# Altium project InductiveCharging.PrjPcb
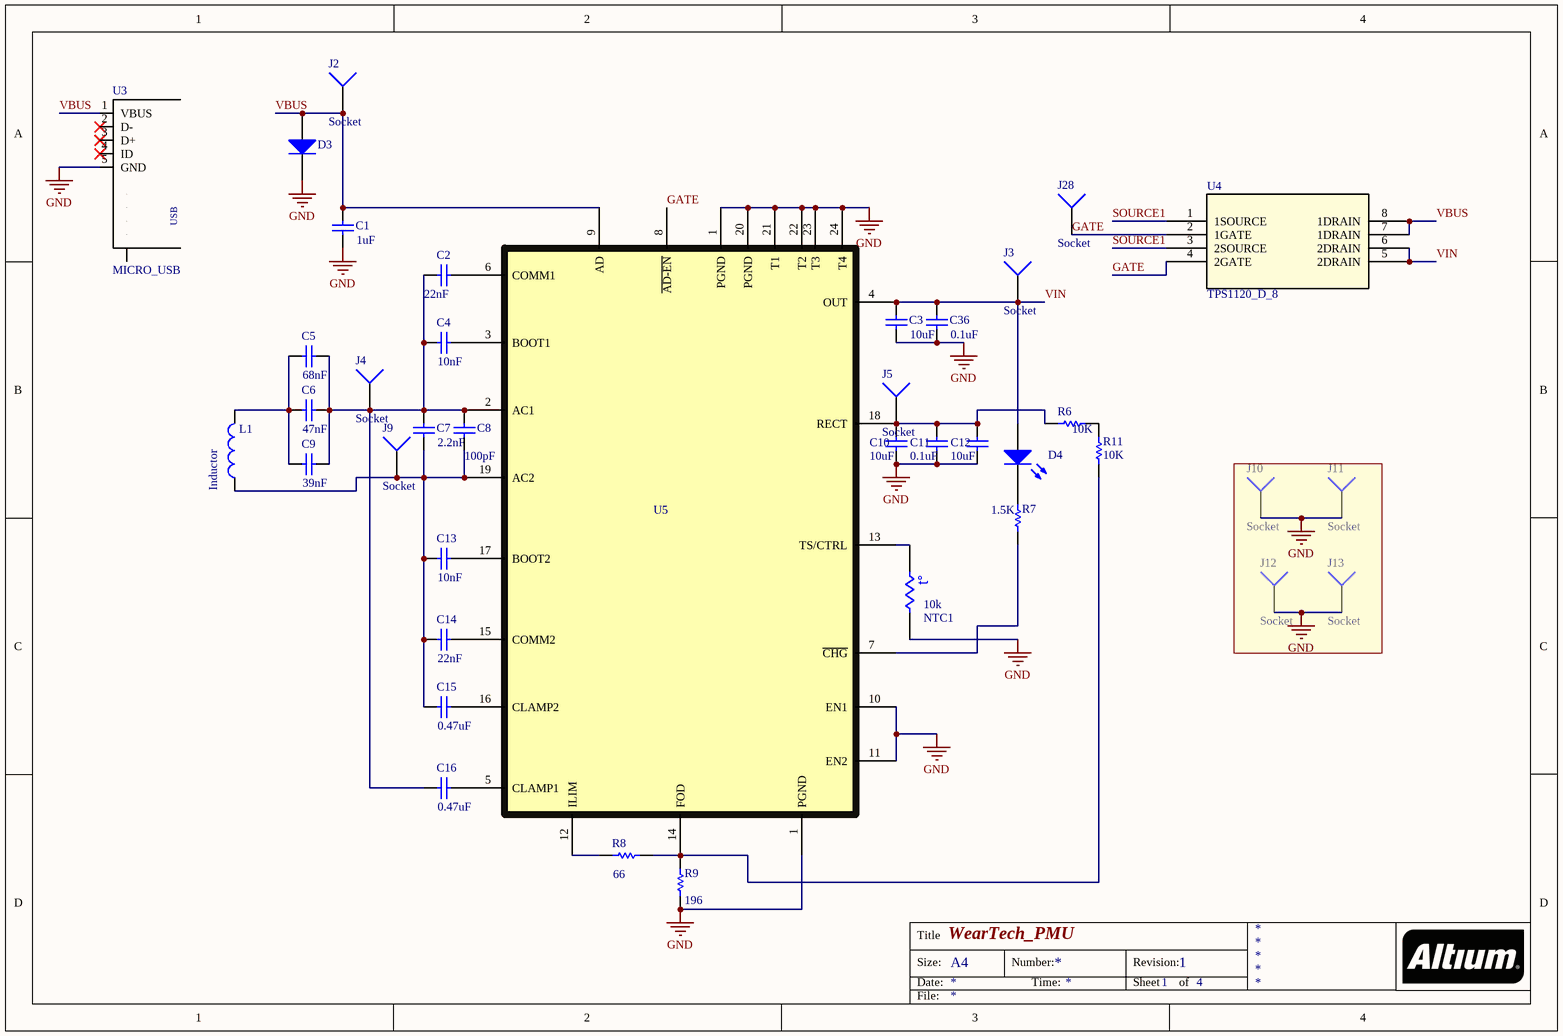
[diagram p0: Inductive.SchDoc]
4 sheets, 100 parts. Net scope: global (net labels, ports and power ports of the same name join across sheets).
Board file: WearTechPCB.PcbDoc
Sheets:
  Inductive.SchDoc
  BatteryCharger.SchDoc
  MCU.SchDoc
  MCU_PART2.SchDoc

## Sheet Inductive.SchDoc: WearTech_PMU
size A4; CompanyName: University Of Colorado Boulder; Revision: 1; SheetNumber: 1; SheetTotal: 4

### Parts
C1  value 1uF  [1608[0603]]  (hidden comment: Cap)
C2  value 22nF  [1608[0603]]  (hidden comment: Cap)
C3  value 10uF  [1608[0603]]  (hidden comment: Cap)
C4  value 10nF  [1608[0603]]  (hidden comment: Cap)
C5  value 68nF  [1608[0603]]  (hidden comment: Cap)
C6  value 47nF  [1608[0603]]  (hidden comment: Cap)
C7  value 2.2nF  [1608[0603]]  (hidden comment: Cap)
C8  value 100pF  [1608[0603]]  (hidden comment: Cap)
C9  value 39nF  [1608[0603]]  (hidden comment: Cap)
C10  value 10uF  [1608[0603]]  (hidden comment: Cap)
C11  value 0.1uF  [1608[0603]]  (hidden comment: Cap)
C12  value 10uF  [1608[0603]]  (hidden comment: Cap)
C13  value 10nF  [1608[0603]]  (hidden comment: Cap)
C14  value 22nF  [1608[0603]]  (hidden comment: Cap)
C15  value 0.47uF  [1608[0603]]  (hidden comment: Cap)
C16  value 0.47uF  [1608[0603]]  (hidden comment: Cap)
C36  value 0.1uF  [1608[0603]]  (hidden comment: Cap)
D3  Diode  [1608[0603]]  (value not drawn)
D4  LED0  [1608[0603]]  (value not drawn)
J2  Socket  [PIN1]
J3  Socket  [PIN1]
J4  Socket  [PIN1]
J5  Socket  [PIN1]
J9  Socket  [PIN1]
J10  Socket  [PIN1]
J11  Socket  [PIN1]
J12  Socket  [PIN1]
J13  Socket  [PIN1]
J28  Socket  [PIN1]
L1  Inductor  [1608[0603]]
NTC1  value 10k  [1608[0603]]  (hidden comment: Res Thermal)
R6  value 10K  [1608[0603]]  (hidden comment: Res1)
R7  value 1.5K  [1608[0603]]  (hidden comment: Res1)
R8  value 66  [1608[0603]]  (hidden comment: Res1)
R9  value 196  [1608[0603]]  (hidden comment: Res1)
R11  value 10K  [1608[0603]]  (hidden comment: Res1)
U3  MICRO_USB  [MICRO USB]
U4  TPS1120_D_8  [BlockSwitch]
U5  BQ51013B  [BQ51013B]  (value not drawn)

### Nets
GND: C1.1 C3.2 C10.2 C11.2 C12.2 C36.2 D3.2(K) J10.1 J11.1 J12.1 J13.1 NTC1.2 R9.2 U3.5(GND) U5.1(PGND) U5.10(EN1) U5.11(EN2) U5.20(PGND) U5.21(T1) U5.22(T2) U5.23(T3) U5.24(T4)
GATE: J28.1 U4.2(1GATE) U4.4(2GATE) U5.8(~{AD-EN})
SOURCE1: U4.1(1SOURCE) U4.3(2SOURCE)
VBUS: C1.2 D3.1(A) J2.1 U3.1(VBUS) U4.7(1DRAIN) U4.8(1DRAIN) U5.9(AD)
VIN: C3.1 C36.1 D4.1(A) J3.1 U4.5(2DRAIN) U4.6(2DRAIN) U5.4(OUT)
NetC2_1: C2.1 U5.6(COMM1)
NetC2_2: C2.2 C4.2 C5.1 C6.1 C7.1 C8.1 C9.1 C16.2 J4.1 U5.2(AC1)
NetC4_1: C4.1 U5.3(BOOT1)
NetC5_2: C5.2 C6.2 C9.2 L1.2
NetC7_2: C7.2 C8.2 C13.2 C14.2 C15.2 J9.1 L1.1 U5.19(AC2)
NetC10_1: C10.1 C11.1 C12.1 J5.1 R6.1 U5.18(RECT)
NetC13_1: C13.1 U5.17(BOOT2)
NetC14_1: C14.1 U5.15(COMM2)
NetC15_1: C15.1 U5.16(CLAMP2)
NetC16_1: C16.1 U5.5(CLAMP1)
NetD4_2: D4.2(K) R7.1
NetNTC1_1: NTC1.1 U5.13(TS/CTRL)
NetR6_2: R6.2 R11.2
NetR7_2: R7.2 U5.7(~{CHG})
NetR8_1: R8.1 U5.12(ILIM)
NetR8_2: R8.2 R9.1 R11.1 U5.14(FOD)

Not connected (* = marked no-connect by the designer): U3 2(D-)* 3(D+)* 4(ID)* M1(S) M2(S) S1(S) S2(S) S3(S) S4(S)

### Notes on the sheet
- Title
- Size:
- Date:
- A4
- Number:
- Time:
- Revision:
- Sheet
- of
- File:
- (in symbol MICRO_USB) USB
- (in symbol Res Thermal) t°

### Library data of the parts
C1 = Cap: Capacitor; Manufacture Part Number: C0603C105K9PACTU; Manufacturer: KEMET; Description: CAP CER 1UF 6.3V X5R 0603; Link: http://psearch.en.murata.com/browser/nosupport/?return=capacitor/product/GRM188R61E105KAAD%23.html; Link: Link; Digi-Key Part Number: 399-7848-1-ND; ComponentLink1URL: Component1URL; ComponentLink1Description: https://search.kemet.com/component-edge/download/datasheet/C0603C105K9PACTU.pdf
C2 C14 = Cap: Capacitor; Manufacture Part Number: CL10B223KA8NNWC; Manufacturer: Samsung Electro-Mechanics; Description: CAP CER 0.022UF 25V X7R 0603; Digi-Key Part Number: 1276-2000-1-ND; ComponentLink1URL: Component1URL; ComponentLink1Description: https://media.digikey.com/pdf/Data%20Sheets/Samsung%20PDFs/CL_Series_MLCC_ds.pdf
  C2: Link: http://psearch.en.murata.com/capacitor/product/GRM188B11E223MA01%23.html
  C14: Link: https://www.digikey.com/product-detail/en/samsung-electro-mechanics/CL10B223KA8NNWC/1276-2000-1-ND/3890086
C3 = Cap: Capacitor; Manufacture Part Number: GRM188R60J106ME47D; Manufacturer: Murata Electronics North America; Description: CAP CER 10UF 6.3V X5R 0603; Link: https://www.digikey.com/product-detail/en/murata-electronics-north-america/GRM188R60J106ME47D/490-3896-1-ND/965938; Digi-Key Part Number: 490-3896-1-ND; ComponentLink1URL: Component1URL; ComponentLink1Description: http://search.murata.co.jp/Ceramy/image/img/A01X/G101/ENG/GRM188R60J106ME47-01.pdf
C4 C13 = Cap: Capacitor; Manufacture Part Number: CL10B103KA8NNNC; Manufacturer: Samsung Electro-Mechanics; Description: CAP CER 10000PF 25V X7R 0603; Digi-Key Part Number: 1276-1132-1-ND; ComponentLink1URL: Component1URL; ComponentLink1Description: https://media.digikey.com/pdf/Data%20Sheets/Samsung%20PDFs/CL_Series_MLCC_ds.pdf
  C4: Link: http://psearch.en.murata.com/capacitor/product/GRM185R61E105MA12%23.html
  C13: Link: https://www.digikey.com/product-detail/en/samsung-electro-mechanics/CL10B103KA8NNNC/1276-1132-1-ND/3889218
C5 = Cap: Capacitor; Manufacture Part Number: CAP CER 0.068UF 25V X7R 0603; Manufacturer: Murata Electronics North America; Description: GRM188R71E683KA01D; Link: https://www.digikey.com/product-detail/en/murata-electronics-north-america/GRM188R71E683KA01D/490-1523-1-ND/587864; Digi-Key Part Number: 490-1523-1-ND; ComponentLink1URL: Component1URL; ComponentLink1Description: http://search.murata.co.jp/Ceramy/image/img/A01X/G101/ENG/GRM188R71E683KA01-01.pdf
C6 = Cap: Capacitor; Manufacture Part Number: CL10B473KA8NFNC; Manufacturer: Samsung; Description: CAP CER 0.047UF 25V X7R 0603; Link: https://www.digikey.com/product-detail/en/samsung-electro-mechanics/CL10B473KA8NFNC/1276-2072-1-ND/3890158; Digi-Key Part Number: 1276-2072-1-ND; ComponentLink1URL: Component1URL; ComponentLink1Description: https://media.digikey.com/pdf/Data%20Sheets/Samsung%20PDFs/CL_Series_MLCC_ds.pdf
C7 = Cap: Capacitor; Manufacture Part Number: C0603C222K3RACTU; Manufacturer: KEMET; Description: CAP CER 2200PF 25V X7R 0603; Link: https://www.digikey.com/product-detail/en/kemet/C0603C222K3RACTU/399-9040-1-ND/3522557; Digi-Key Part Number: 399-9040-1-ND; ComponentLink1URL: Component1URL; ComponentLink1Description: https://search.kemet.com/component-edge/download/datasheet/C0603C222K3RACTU.pdf
C8 = Cap: Capacitor; Manufacture Part Number: C0603C104K3RACTU; Manufacturer: KEMET; Description: CAP CER 0.1UF 25V X7R 0603; Link: https://www.digikey.com/product-detail/en/kemet/C0603C104K3RACTU/399-1281-1-ND/416057; Digi-Key Part Number: 399-1281-1-ND; ComponentLink1URL: Component1URL; ComponentLink1Description: https://search.kemet.com/component-edge/download/datasheet/C0603C104K3RACTU.pdf
C9 = Cap: Capacitor; Manufacture Part Number: C0603C393K3RACTU; Manufacturer: KEMET; Description: CAP CER 0.039UF 25V X7R 0603; Link: https://www.digikey.com/product-detail/en/kemet/C0603C393K3RACTU/399-7914-1-ND/3471637; Digi-Key Part Number: 399-7914-1-ND; ComponentLink1URL: Component1URL; ComponentLink1Description: https://search.kemet.com/component-edge/download/datasheet/C0603C393K3RACTU.pdf
C10 = Cap: Capacitor; Manufacture Part Number: GRM188R61C106KAALD; Manufacturer: Murata Electronics North AmericaMurata Electronics North America; Description: CAP CER 10UF 16V X5R 0603; Link: https://www.digikey.com/product-detail/en/murata-electronics-north-america/GRM188R61C106KAALD/490-10728-1-ND/5251372; Digi-Key Part Number: 490-10728-1-ND; ComponentLink1URL: Component1URL; ComponentLink1Description: http://search.murata.co.jp/Ceramy/image/img/A01X/G101/ENG/GRM188R61C106KAAL-01.pdf
C11 = Cap: Capacitor; Manufacture Part Number: CAP CER 0.1UF 16V X7R 0603; Description: 0603YC104JAT2A; Link: https://www.digikey.com/product-detail/en/avx-corporation/0603YC104JAT2A/478-3726-1-ND/1116424; Digi-Key Part Number: Digi-Key Part Number; ComponentLink1URL: Component1URL; ComponentLink1Description: cOM; Manufacturer: Manufacturer
C12 = Cap: Capacitor; Manufacture Part Number: GRM188R61C106KAALD; Manufacturer: Murata Electronics North America; Description: CAP CER 10UF 16V X5R 0603; Link: https://www.digikey.com/product-detail/en/murata-electronics-north-america/GRM188R61C106KAALD/490-10728-1-ND/5251372; Digi-Key Part Number: 490-10728-1-ND; ComponentLink1URL: Component1URL; ComponentLink1Description: http://search.murata.co.jp/Ceramy/image/img/A01X/G101/ENG/GRM188R61C106KAAL-01.pdf
C15 = Cap: Capacitor; Manufacture Part Number: CAP CER 0.47UF 25V X7R 0603; Manufacturer: Murata Electronics North America; Description: GRM188R71E474KA12D; Link: https://www.digikey.com/product-detail/en/murata-electronics-north-america/GRM188R71E474KA12D/490-3291-1-ND/702832; Digi-Key Part Number: 490-3291-1-ND; ComponentLink1URL: Component1URL; ComponentLink1Description: http://search.murata.co.jp/Ceramy/image/img/A01X/G101/ENG/GRM188R71E474KA12-01.pdf
C16 = Cap: Capacitor; Manufacture Part Number: GRM188R71E474KA12D; Manufacturer: Murata Electronics North America; Description: CAP CER 0.47UF 25V X7R 0603; Link: https://www.digikey.com/product-detail/en/murata-electronics-north-america/GRM188R71E474KA12D/490-3291-1-ND/702832; Digi-Key Part Number: 490-3291-1-ND; ComponentLink1URL: Component1URL; ComponentLink1Description: http://search.murata.co.jp/Ceramy/image/img/A01X/G101/ENG/GRM188R71E474KA12-01.pdf
C36 = Cap: Capacitor; Manufacture Part Number: GRM188R70J104KA01D; Manufacturer: Murata Electronics North America; Description: CAP CER 0.1UF 6.3V X7R 0603; Link: https://www.digikey.com/product-detail/en/murata-electronics-north-america/GRM188R70J104KA01D/490-9730-1-ND/4934899; Digi-Key Part Number: 490-9730-1-ND; ComponentLink1URL: Component1URL; ComponentLink1Description: http://search.murata.co.jp/Ceramy/image/img/A01X/G101/ENG/GRM188R70J104KA01-01.pdf
D3 = Diode: Default Diode; Manufacture Part Number: SMF05CT1G; Manufacturer: ON Semiconductor; Description: TVS DIODE 5VWM 12.5VC SC88; Link: https://www.digikey.com/product-detail/en/SMF05CT1G/SMF05CT1GOSCT-ND/1967287; Digi-Key Part Number: SMF05CT1GOSCT-ND; ComponentLink1URL: Component1URL; ComponentLink1Description: http://www.onsemi.com/pub/Collateral/SMF05C-D.PDF
D4 = LED0: Typical INFRARED GaAs LED; Manufacture Part Number: LO L29K-H2K1-24-Z; Manufacturer: OSRAM Opto Semiconductors Inc.; Description: LED ORANGE DIFFUSED 0603 SMD; Link: https://www.digikey.com/product-detail/en/yageo/RC0603JR-0710KL/311-10KGRCT-ND/729647; Digi-Key Part Number: 475-2740-1-ND; ComponentLink1URL: Component1URL; ComponentLink1Description: http://www.osram-os.com/Graphics/XPic0/00077105_0.pdf
J2-J5 J9-J13 J28 = Socket: Manufacture Part Number: 68000-200HLF; Manufacturer: Amphenol FCI; Description: Description; Link: https://www.digikey.com/product-detail/en/amphenol-fci/68000-200HLF/609-5099-1-ND/5968545; Digi-Key Part Number: 609-5099-1-ND; ComponentLink1URL: Component1URL; ComponentLink1Description: http://cdn.amphenol-icc.com/media/wysiwyg/files/drawing/68000.pdf
L1 = Inductor: RX 1 COIL 1 LAYER 10.7UH; Manufacturer: Vishay Dale; Value: 10mH; Manufacture Part Number: Manufacture Part Number; Link: https://www.digikey.com/product-detail/en/vishay-dale/IWAS3827ECEB100J50/541-1695-ND/3641244; Digi-Key Part Number: 541-1695-ND; ComponentLink1URL: Component1URL; ComponentLink1Description: http://www.vishay.com/docs/34338/iwas3827.pdf
NTC1 = Res Thermal: Thermistor; Manufacturer: Yageo; Description: RC0603JR-0710KL; Manufacture Part Number: RC0603JR-0710KL; Link: https://www.digikey.com/product-detail/en/yageo/RC0603JR-0710KL/311-10KGRCT-ND/729647; Digi-Key Part Number: 311-10KGRCT-ND; ComponentLink1URL: Component1URL; ComponentLink1Description: http://www.yageo.com.tw/exep/pages/download/literatures/PYu-R_INT-thick_7.pdf
R6 R11 = Res1: Resistor; Manufacture Part Number: RC0603JR-0710KL; Manufacturer: Yageo; Description: RES SMD 10K OHM 5% 1/10W 0603; Link: https://www.digikey.com/product-detail/en/yageo/RC0603JR-0710KL/311-10KGRCT-ND/729647; Digi-Key Part Number: 311-10KGRCT-ND; ComponentLink1URL: Component1URL; ComponentLink1Description: http://www.yageo.com.tw/exep/pages/download/literatures/PYu-R_INT-thick_7.pdf
R7 = Res1: Resistor; Manufacture Part Number: RC0603JR-071K5L; Manufacturer: Yageo; Description: RES SMD 1.5K OHM 5% 1/10W 0603; Link: https://www.digikey.com/product-detail/en/yageo/RC0603JR-071K5L/311-1.5KGRCT-ND/729636; Digi-Key Part Number: 311-1.5KGRCT-ND; ComponentLink1URL: Component1URL; ComponentLink1Description: http://www.yageo.com.tw/exep/pages/download/literatures/PYu-R_INT-thick_7.pdf
R8 = Res1: Resistor; Manufacture Part Number: RC0603FR-0766R5L; Manufacturer: Yageo; Description: RES SMD 66.5 OHM 1% 1/10W 0603; Link: https://www.digikey.com/product-detail/en/yageo/RC0603FR-0766R5L/311-66.5HRCT-ND/730294; Digi-Key Part Number: 311-66.5HRCT-ND; ComponentLink1URL: Component1URL; ComponentLink1Description: http://www.yageo.com/documents/recent/PYu-RC_Group_51_RoHS_L_8.pdf
R9 = Res1: Resistor; Manufacture Part Number: RC0603FR-07196RL; Manufacturer: Yageo; Description: RES SMD 196 OHM 1% 1/10W 0603; Link: https://www.digikey.com/product-detail/en/yageo/RC0603FR-07196RL/311-196HRCT-ND/729953; Digi-Key Part Number: 311-196HRCT-ND; ComponentLink1URL: Component1URL; ComponentLink1Description: http://www.yageo.com/documents/recent/PYu-RC_Group_51_RoHS_L_8.pdf
U3 = MICRO_USB: CONN USB MICRO B RECPT SMT R/A; Manufacture Part Number: 10118192-0001LF; Manufacturer: Amphenol FCI; Link: https://www.digikey.com/product-detail/en/amphenol-fci/10118192-0001LF/609-4613-1-ND/2785378; Digi-Key Part Number: 609-4613-1-ND; ComponentLink1URL: Component1URL; ComponentLink1Description: http://cdn.amphenol-icc.com/media/wysiwyg/files/drawing/10118192.pdf
U4 = TPS1120_D_8: Manufacturer: Texas Instruments; Description: Description; Manufacture Part Number: Manufacture Part Number; Link: https://www.digikey.com/products/en/discrete-semiconductor-products/transistors-fets-mosfets-arrays/289?k=tps1120&k=&pkeyword=tps1120&pv7=2&FV=ffe00121&mnonly=0&ColumnSort=0&page=1&stock=1&quantity=0&ptm=0&fid=0&pageSize=25; Digi-Key Part Number: 296-1352-1-ND; ComponentLink1URL: Component1URL; ComponentLink1Description: http://www.ti.com/lit/gpn/TPS1120
U5 = BQ51013B: Manufacture Part Number: BQ51013BRHLR; Manufacturer: Texas Instruments; Description: IC WIRELESS PWR RCVR 20QFN; Link: https://www.digikey.com/product-detail/en/texas-instruments/BQ51013BRHLR/296-38885-1-ND/5142996; Digi-Key Part Number: 296-38885-1-ND; ComponentLink1URL: Component1URL; ComponentLink1Description: http://www.ti.com/lit/ds/symlink/bq51013b.pdf

## Sheet BatteryCharger.SchDoc: WearTech_PMU_Part2
size A4; DrawnBy: WearTech; Revision: 1; SheetNumber: 2; SheetTotal: 4
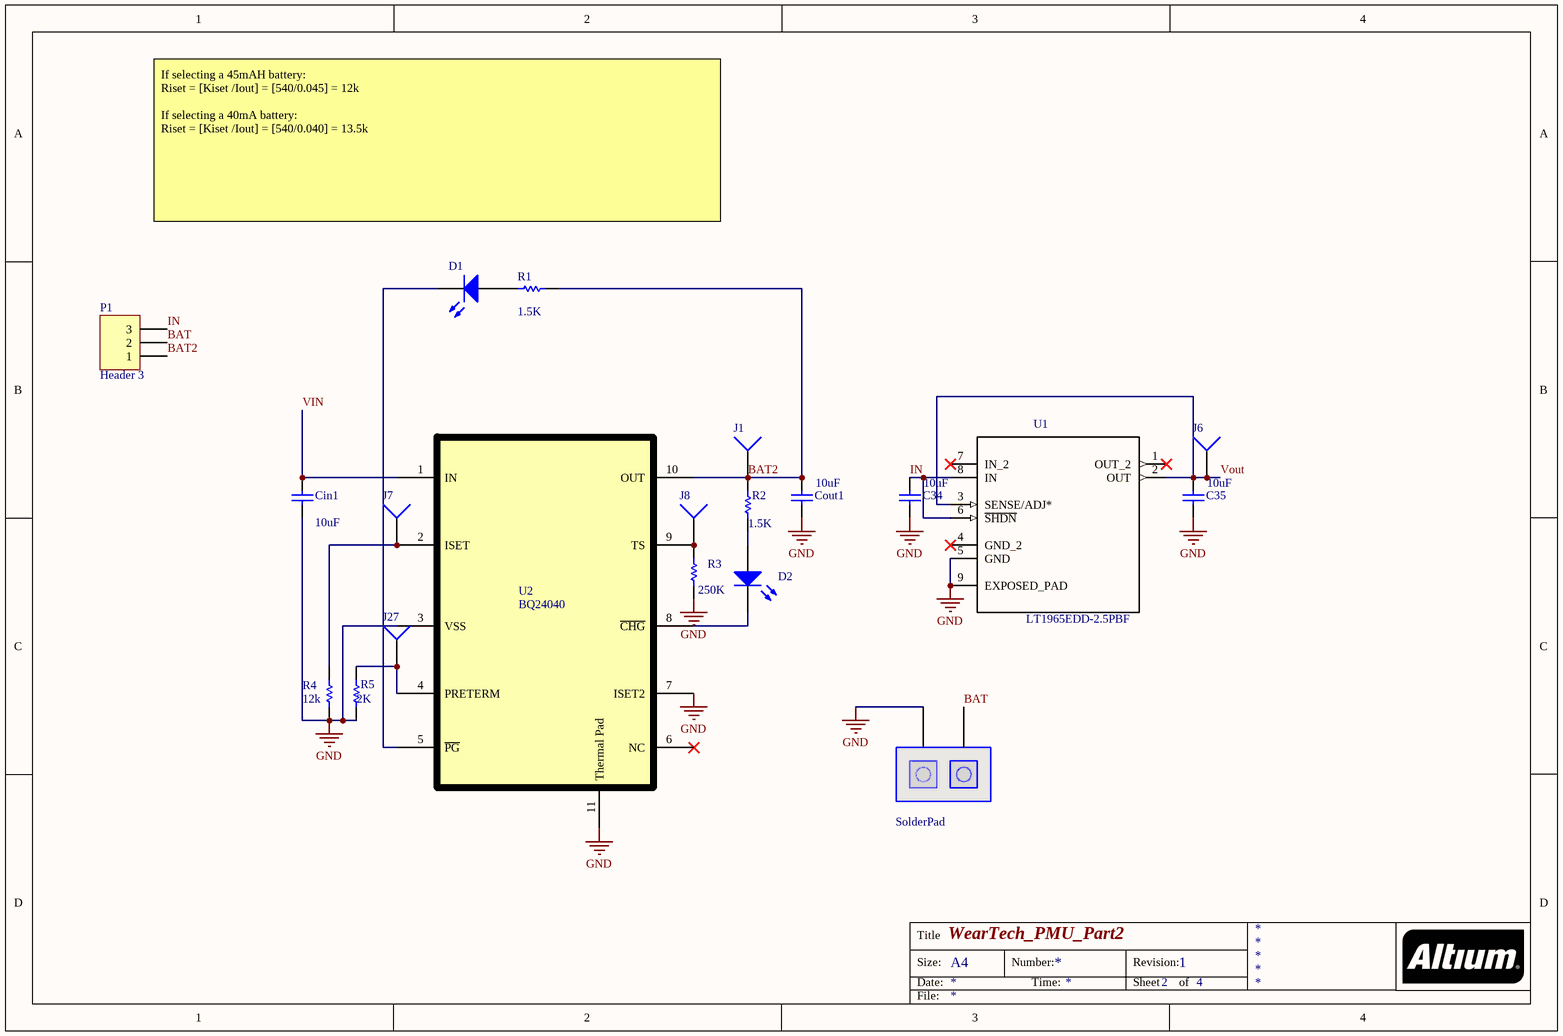
[diagram p1: BatteryCharger.SchDoc]

### Parts
1  SolderPad  [bATTERY_CONNECTION]
C34  value 10uF  [1608[0603]]  (hidden comment: Cap)
C35  value 10uF  [1608[0603]]  (hidden comment: Cap)
Cin1  value 10uF  [1608[0603]]  (hidden comment: Cap)
Cout1  value 10uF  [1608[0603]]  (hidden comment: Cap)
D1  LED0  [1608[0603]]  (value not drawn)
D2  LED0  [1608[0603]]  (value not drawn)
J1  Socket  [PIN1]  (value not drawn)
J6  Socket  [PIN1]  (value not drawn)
J7  Socket  [PIN1]  (value not drawn)
J8  Socket  [PIN1]  (value not drawn)
J27  Socket  [PIN1]  (value not drawn)
P1  Header 3  [HDR1X3]
R1  value 1.5K  [1608[0603]]  (hidden comment: Res1)
R2  value 1.5K  [1608[0603]]  (hidden comment: Res1)
R3  value 250K  [1608[0603]]  (hidden comment: Res1)
R4  value 12k  [1608[0603]]  (hidden comment: Res1)
R5  value 2K  [1608[0603]]  (hidden comment: Res1)
U1  LT1965EDD-2.5PBF  [LT1965]
U2  BQ24040  [BQ24040]

### Nets
GND: 1.2(GND) C34.2 C35.2 Cin1.2 Cout1.2 R3.1 R4.2 R5.2 U1.5(GND) U1.9(EXPOSED_PAD) U2.3(VSS) U2.7(ISET2) U2.11(Thermal_Pad)
BAT: 1.1(BAT) P1.2
BAT2: Cout1.1 J1.1 P1.1 R1.2 R2.1 U2.10(OUT)
IN: C34.1 P1.3 U1.6(~{SHDN}) U1.8(IN)
VIN: Cin1.1 U2.1(IN)
Vout: C35.1 J6.1 U1.2(OUT) U1.3(SENSE/ADJ*)
NetD1_1: D1.1(A) R1.1
NetD1_2: D1.2(K) U2.5(~{PG})
NetD2_1: D2.1(A) R2.2
NetD2_2: D2.2(K) U2.8(~{CHG})
NetJ7_1: J7.1 R4.1 U2.2(ISET)
NetJ8_1: J8.1 R3.2 U2.9(TS)
NetJ27_1: J27.1 R5.1 U2.4(PRETERM)

Not connected (* = marked no-connect by the designer): U1 1(OUT_2)* 4(GND_2)* 7(IN_2)*; U2 6(NC)*

### Notes on the sheet
- If selecting a 45mAH battery:
  Riset = [Kiset /Iout] = [540/0.045] = 12k
  If selecting a 40mA battery:
  Riset = [Kiset /Iout] = [540/0.040] = 13.5k
- Title
- Size:
- Date:
- A4
- Number:
- Time:
- Revision:
- Sheet
- of
- File:

### Library data of the parts
1 = SolderPad: Manufacturer: b; Link: Link; Description: Description; Manufacture Part Num: Manufacture Part Num; DigiKey Part Number: D; ComponentLink1URL: Datasheet; ComponentLink1Description: c
C34 Cout1 = Cap: Capacitor; Manufacture Part Num: 06034D106MAT2A; Manufacturer: AVX Corporation; Description: CAP CER 10UF 4V X5R 0603; Link: https://www.digikey.com/product-detail/en/avx-corporation/06034D106MAT2A/478-5718-1-ND/2136326; DigiKey Part Number: 478-5718-1-ND; ComponentLink1URL: Datasheet; ComponentLink1Description: http://datasheets.avx.com/cx5r.pdf
C35 = Cap: Capacitor; Manufacture Part Num: 06034D106MAT2A; Manufacturer: Murata Electronics North America; Description: CAP CER 10UF 4V X5R 0603; Link: https://www.digikey.com/product-detail/en/avx-corporation/06034D106MAT2A/478-5718-1-ND/2136326; DigiKey Part Number: 490-8278-1-ND; ComponentLink1URL: Datasheet; ComponentLink1Description: http://search.murata.co.jp/Ceramy/image/img/A01X/partnumbering_e_01.pdf
Cin1 = Cap: Capacitor; Manufacture Part Num: GRM188R60J106ME47D; Manufacturer: Murata Electronics North America; Description: CAP CER 10UF 6.3V X5R 0603; Link: https://www.digikey.com/product-detail/en/murata-electronics-north-america/GRM188R60J106ME47D/490-3896-1-ND/965938; DigiKey Part Number: 490-3896-1-ND; ComponentLink1URL: Datasheet; ComponentLink1Description: http://search.murata.co.jp/Ceramy/image/img/A01X/G101/ENG/GRM188R60J106ME47-01.pdf
D1 D2 = LED0: Typical INFRARED GaAs LED; Manufacture Part Num: LO L29K-H2K1-24-Z; Manufacturer: OSRAM Opto Semiconductors Inc.; Description: LED ORANGE DIFFUSED 0603 SMD; Link: https://www.digikey.com/product-detail/en/osram-opto-semiconductors-inc/LO-L29K-H2K1-24-Z/475-2740-1-ND/1938907; ComponentLink1URL: Datasheet; ComponentLink1Description: http://www.osram-os.com/Graphics/XPic0/00077105_0.pdf
  D1: DigiKey Part Number: 475-2740-1-ND
  D2: DigiKey Part Number: 475475-2740-1-ND
J1 J6-J8 J27 = Socket: Manufacture Part Num: 68000-200HLF; Manufacturer: Amphenol FCI; Link: https://www.digikey.com/product-detail/en/amphenol-fci/68000-200HLF/609-5099-1-ND/5968545; Description: Description; DigiKey Part Number: 609-5099-1-ND; ComponentLink1URL: Datasheet; ComponentLink1Description: http://cdn.amphenol-icc.com/media/wysiwyg/files/drawing/68000.pdf
P1 = Header 3: Header, 3-Pin; Manufacturer: Wurth Electronics Inc.; Description: CONN HEADER 3 POS 2.54; Link: https://www.digikey.com/product-detail/en/wurth-electronics-inc/61300311121/732-5316-ND/4846825; Manufacture Part Num: Manufacture Part Num; DigiKey Part Number: 732-5316-ND; ComponentLink1URL: Datasheet; ComponentLink1Description: http://katalog.we-online.de/em/datasheet/6130xx11121.pdf
R1 R2 = Res1: Resistor; Manufacture Part Num: RC0603JR-071K5L; Manufacturer: Yageo; Description: RES SMD 1.5K OHM 5% 1/10W 0603; Link: https://www.digikey.com/product-detail/en/yageo/RC0603JR-071K5L/311-1.5KGRCT-ND/729636; DigiKey Part Number: 311-1.5KGRCT-ND; ComponentLink1URL: Datasheet; ComponentLink1Description: http://www.yageo.com.tw/exep/pages/download/literatures/PYu-R_INT-thick_7.pdf
R3 = Res1: Resistor; Manufacture Part Num: RC0402JR-0710KL; Manufacturer: Yageo; Description: RES SMD 10K OHM 5% 1/16W 0402; Link: https://www.digikey.com/product-detail/en/yageo/RC0402JR-0710KL/311-10KJRTR-ND/726418; DigiKey Part Number: 311-12KGRCT-ND; ComponentLink1URL: Datasheet; ComponentLink1Description: http://www.yageo.com/documents/recent/PYu-RC_Group_51_RoHS_L_8.pdf
R4 = Res1: Resistor; Manufacture Part Num: RC0603JR-0712KL; Manufacturer: Yageo; Description: RES SMD 12K OHM 5% 1/10W 0603; Link: https://www.digikey.com/product-detail/en/yageo/RC0603JR-0712KL/311-12KGRCT-ND/729656; DigiKey Part Number: 311-12KGRCT-ND; ComponentLink1URL: Datasheet; ComponentLink1Description: http://www.yageo.com/documents/recent/PYu-RC_Group_51_RoHS_L_8.pdf
R5 = Res1: Resistor; Manufacture Part Num: ERJ-3EKF2001V; Manufacturer: Panasonic Electronic Components; Description: RES SMD 2K OHM 1% 1/10W 0603; Link: https://www.digikey.com/product-detail/en/panasonic-electronic-components/ERJ-3EKF2001V/P2.00KHCT-ND/198219; DigiKey Part Number: P2.00KHCT-ND; ComponentLink1URL: Datasheet; ComponentLink1Description: https://industrial.panasonic.com/cdbs/www-data/pdf/RDA0000/AOA0000C304.pdf
U1 = LT1965EDD-2.5PBF: PMIC - LDO voltage regulator Linear Technology LT1965EDD-2.5#PBF Positive, fixed DFN 8 (3x3); Manufacture Part Num: LT1965IDD-2.5#PBF; Description: IC REG LINEAR 2.5V 1.1A 8DFN; Value: *; Link: https://www.digikey.com/product-detail/en/linear-technology/LT1965IDD-2.5-PBF/LT1965IDD-2.5-PBF-ND/2107616; DigiKey Part Number: LT1965IDD-2.5#PBF-ND; ComponentLink1URL: Datasheet; ComponentLink1Description: http://www.linear.com/docs/25320; Manufacturer: Linear Technology
U2 = BQ24040: Manufacture Part Num: BQ24040DSQT; Manufacturer: Texas Instruments; Description: IC BATT CHG LI-ION 1 CELL 10SON; Link: https://www.digikey.com/products/en/integrated-circuits-ics/pmic-battery-chargers/781?k=BQ24040DSQT&k=&pkeyword=BQ24040DSQT&pv7=2&mnonly=0&ColumnSort=0&page=1&stock=1&quantity=0&ptm=0&fid=0&pageSize=25; DigiKey Part Number: 296-25136-1-ND; ComponentLink1URL: Datasheet; ComponentLink1Description: http://www.ti.com/lit/ds/symlink/bq24040.pdf

## Sheet MCU.SchDoc: WearTech-MCU_P1
size A4; Revision: 1; SheetNumber: 2; SheetTotal: 3; ProjectName: WearTech
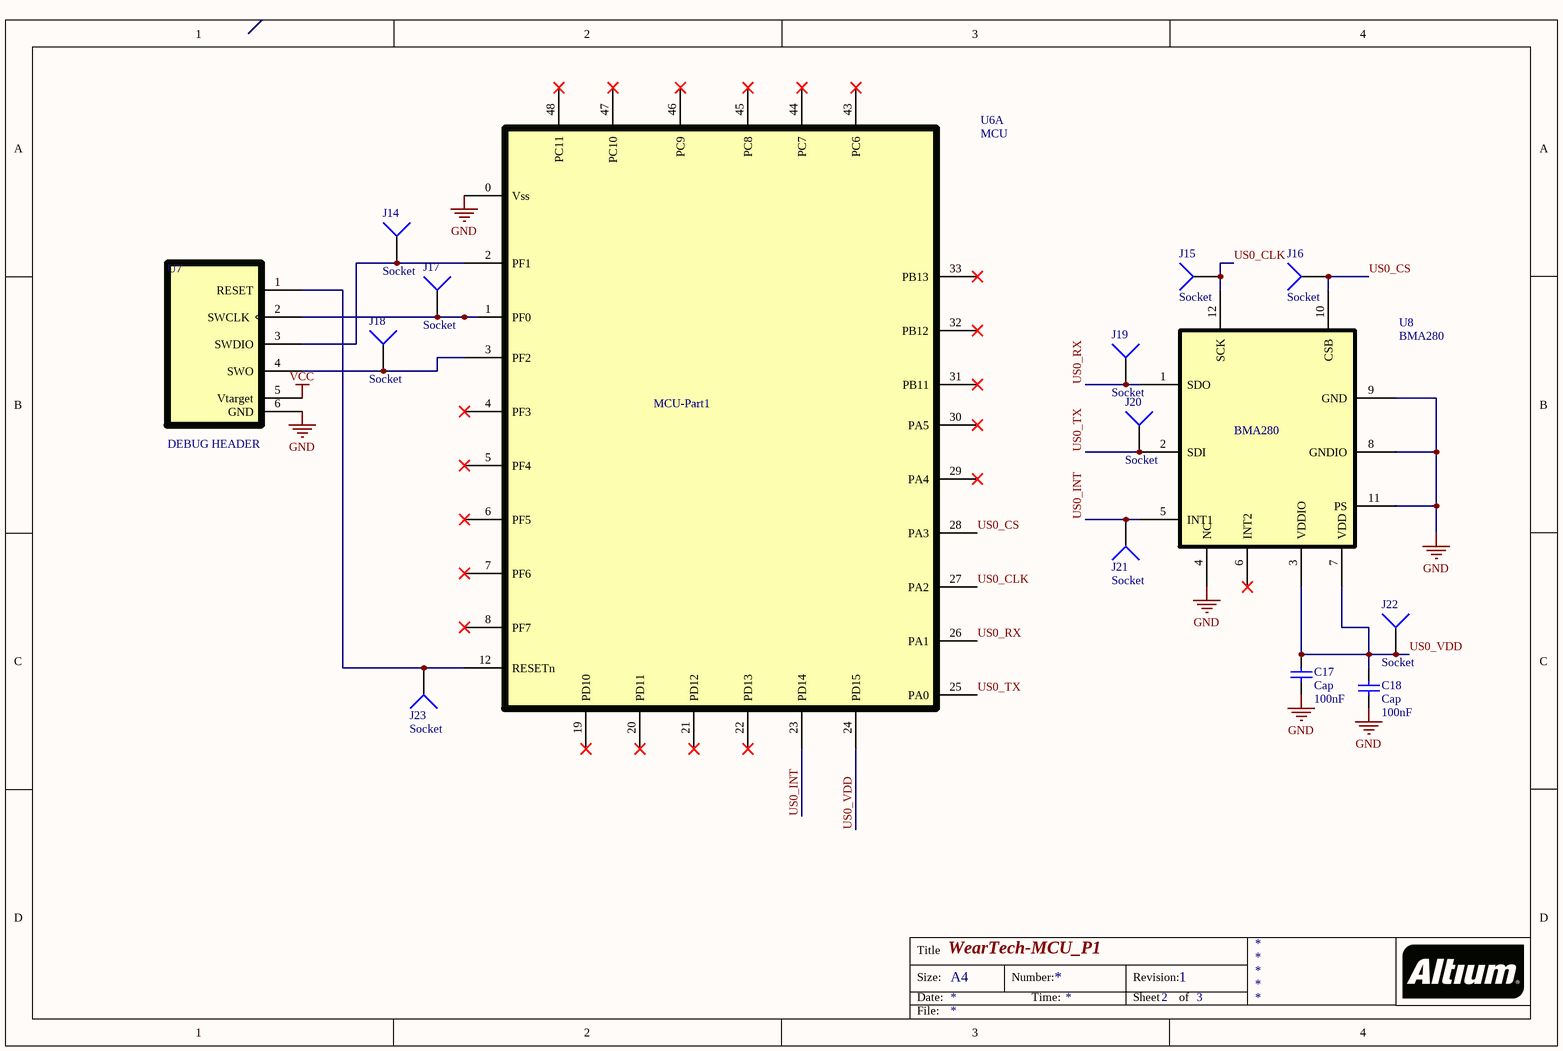
[diagram p2: MCU.SchDoc]

### Parts
C17  Cap  value 100nF  [1608[0603]]
C18  Cap  value 100nF  [1608[0603]]
J14  Socket  [PIN1]
J15  Socket  [PIN1]
J16  Socket  [PIN1]
J17  Socket  [PIN1]
J18  Socket  [PIN1]
J19  Socket  [PIN1]
J20  Socket  [PIN1]
J21  Socket  [PIN1]
J22  Socket  [PIN1]
J23  Socket  [PIN1]
U6  MCU  [QFN50P700X700X90_HS-49N]  (part A of 2)
U7  DEBUG HEADER  [HDR1X6]
U8  BMA280  [QFN50P200X200X100-12N]

### Nets
GND: C17.1 C18.1 U6.0(Vss) U7.6(GND) U8.4(NC) U8.8(GNDIO) U8.9(GND) U8.11(PS)
VCC: U7.5(Vtarget)
US0_CLK: J15.1 U6.27(PA2) U8.12(SCK)
US0_CS: J16.1 U6.28(PA3) U8.10(CSB)
US0_INT: J21.1 U6.23(PD14) U8.5(INT1)
US0_RX: J19.1 U6.26(PA1) U8.1(SDO)
US0_TX: J20.1 U6.25(PA0) U8.2(SDI)
US0_VDD: C17.2 C18.2 J22.1 U6.24(PD15) U8.3(VDDIO) U8.7(VDD)
NetJ14_1: J14.1 U6.2(PF1) U7.3(SWDIO)
NetJ17_1: J17.1 U6.1(PF0) U7.2(SWCLK)
NetJ18_1: J18.1 U6.3(PF2) U7.4(SWO)
NetJ23_1: J23.1 U6.12(RESETn) U7.1(RESET)

Not connected (* = marked no-connect by the designer): U6 4(PF3)* 5(PF4)* 6(PF5)* 7(PF6)* 8(PF7)* 19(PD10)* 20(PD11)* 21(PD12)* 22(PD13)* 29(PA4)* 30(PA5)* 31(PB11)* 32(PB12)* 33(PB13)* 43(PC6)* 44(PC7)* 45(PC8)* 46(PC9)* 47(PC10)* 48(PC11)*; U8 6(INT2)*

### Notes on the sheet
- (near U6) MCU-Part1
- (near U8) BMA280
- Title
- Size:
- Date:
- A4
- Number:
- Time:
- Revision:
- Sheet
- of
- File:

### Library data of the parts
C17 C18 = Cap: CAP CER 0.1UF 16V X7R 0603; Manufacturer: Murata Electronics North America; Manufacturer Part Number: GRM188R71C104KA01D; Digikey Part Number: 490-1532-1-ND; ComponentLink1URL: http://search.murata.co.jp/Ceramy/image/img/A01X/G101/ENG/GRM188R71C104KA01-01.pdf; ComponentLink1Description: Datasheet
J14-J23 = Socket: Manufacturer: Amphenol FCI; Manufacturer Part Number: 68000-200HLF; Description: BERGSTRIP .100" DR STRAIGHT; Digikey Part Number: 609-5099-1-ND; ComponentLink1URL: http://cdn.amphenol-icc.com/media/wysiwyg/files/drawing/68000.pdf; ComponentLink1Description: Datasheet
U6 = MCU: RF System on a Chip - SoC Blue Premium 19dBm 2.4G 512kB 64kB(RAM); Manufacturer: Silicon Labs; Manufacturer Part Number: EFR32BG13P732F512GM48-C; Mouser Part Number: 634-EFR32BG13P732-C; ComponentLink1URL: http://www.mouser.com/ds/2/368/efr32bg13-datasheet-1114948.pdf; ComponentLink1Description: Datasheet
U7 = DEBUG HEADER: BERGSTRIP .100" DR STRAIGHT; Manufacturer: Amphenol FCI; Manufacturer Part Number: 68000-200HLF; Digikey Part Number: 609-5099-1-ND; ComponentLink1URL: http://cdn.amphenol-icc.com/media/wysiwyg/files/drawing/68000.pdf; ComponentLink1Description: ComponentLink1Description
U8 = BMA280: Accelerometers 3-Axis 2x2mm LGA-12 2g-16g prog 14-bit; Manufacturer: Bosch Sensortec; Manufacturer Part Number: BMA280; Mouser Part Number: 262-BMA280; ComponentLink1URL: http://www.mouser.com/ds/2/783/BST-BMA280-DS000-11_published-786496.pdf; ComponentLink1Description: Datasheet

## Sheet MCU_PART2.SchDoc: WearTech-MCU-P2
size A4; Revision: 1; SheetNumber: 3; SheetTotal: 3; ProjectName: WearTech
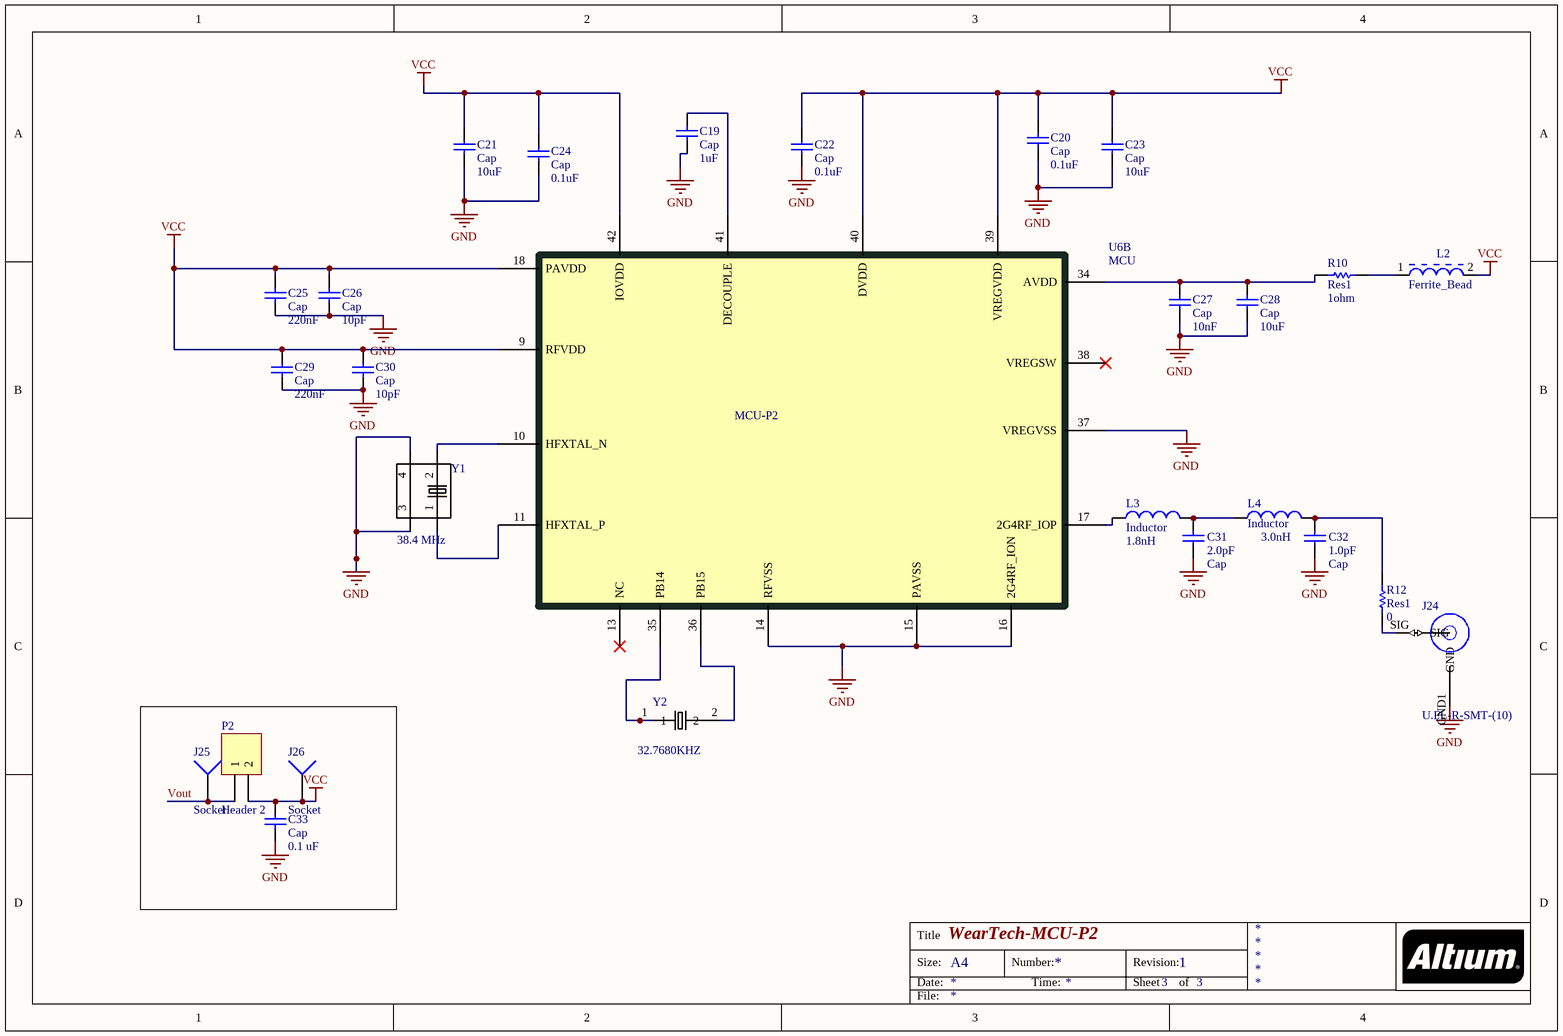
[diagram p3: MCU_PART2.SchDoc]

### Parts
C19  Cap  value 1uF  [1608[0603]]
C20  Cap  value 0.1uF  [1608[0603]]
C21  Cap  value 10uF  [1608[0603]]
C22  Cap  value 0.1uF  [1608[0603]]
C23  Cap  value 10uF  [1608[0603]]
C24  Cap  value 0.1uF  [1608[0603]]
C25  Cap  value 220nF  [1608[0603]]
C26  Cap  value 10pF  [1608[0603]]
C27  Cap  value 10nF  [1608[0603]]
C28  Cap  value 10uF  [1608[0603]]
C29  Cap  value 220nF  [1608[0603]]
C30  Cap  value 10pF  [1608[0603]]
C31  Cap  value 2.0pF  [1608[0603]]
C32  Cap  value 1.0pF  [1608[0603]]
C33  Cap  value 0.1 uF  [1608[0603]]
J24  U.FL-R-SMT-(10)
J25  Socket  [PIN1]
J26  Socket  [PIN1]
L2  Ferrite_Bead
L3  Inductor  value 1.8nH  [1608[0603]]
L4  Inductor  value 3.0nH  [1608[0603]]
P2  Header 2  [HDR1X2]
R10  Res1  value 1ohm  [1608[0603]]
R12  Res1  value 0  [1608[0603]]
U6  MCU  [QFN50P700X700X90_HS-49N]  (part B of 2)
Y1  value 38.4 MHz  (hidden comment: X1)
Y2  value 32.7680KHZ  [X2]  (hidden comment: X2)

### Nets
GND: C19.1 C20.1 C21.1 C22.1 C23.1 C24.1 C25.1 C26.1 C27.1 C28.1 C29.1 C30.1 C31.1 C32.1 C33.1 J24.GND1(GND) U6.14(RFVSS) U6.15(PAVSS) U6.16(2G4RF_ION) U6.37(VREGVSS) Y1.3 Y1.4
VCC: C20.2 C21.2 C22.2 C23.2 C24.2 C25.2 C26.2 C29.2 C30.2 C33.2 J26.1 L2.2 P2.2 U6.9(RFVDD) U6.18(PAVDD) U6.39(VREGVDD) U6.40(DVDD) U6.42(IOVDD)
Vout: J25.1 P2.1
NetC19_2: C19.2 U6.41(DECOUPLE)
NetC27_2: C27.2 C28.2 R10.1 U6.34(AVDD)
NetC31_2: C31.2 L3.2 L4.1
NetC32_2: C32.2 L4.2 R12.2
NetJ24_SIG: J24.SIG R12.1
NetL2_1: L2.1 R10.2
NetL3_1: L3.1 U6.17(2G4RF_IOP)
NetU6_10: U6.10(HFXTAL_N) Y1.2
NetU6_11: U6.11(HFXTAL_P) Y1.1
NetU6_35: U6.35(PB14) Y2.1
NetU6_36: U6.36(PB15) Y2.2

Not connected (* = marked no-connect by the designer): U6 13(NC)* 38(VREGSW)*

### Notes on the sheet
- (near U6) MCU-P2
- Title
- Size:
- Date:
- A4
- Number:
- Time:
- Revision:
- Sheet
- of
- File:

### Library data of the parts
C19 = Cap: CAP CER 1UF 25V X5R 0603; Manufacturer Part-Number: CL10A105KA5LNNC; ComponentLink1URL: http://www.samsungsem.com/kr/support/library/product-catalog/__icsFiles/afieldfile/2017/09/13/MLCC.pdf; Manufacturer: Manufacturer; ComponentLink1Description: Datasheet; Digikey Part Number: 1276-1858-1-ND
C20 C22 C24 C33 = Cap: CAP CER 0.1UF 16V X7R 0603; Manufacturer Part-Number: GRM188R71C104KA01D; Manufacturer: Murata Electronics North America; ComponentLink1URL: http://search.murata.co.jp/Ceramy/image/img/A01X/G101/ENG/GRM188R71C104KA01-01.pdf; ComponentLink1Description: Datasheet; Digikey Part Number: 490-1532-1-ND
C21 C23 C28 = Cap: CAP CER 22UF 4V X5R 0603; Manufacturer Part-Number: CL10A226MR8NQNC; Manufacturer: Samsung Electro-Mechanics; ComponentLink1URL: http://www.samsungsem.com/kr/support/product-search/mlcc/__icsFiles/afieldfile/2016/12/21/CL10A226MR8NQNC_161221_1.pdf; ComponentLink1Description: Datasheet; Digikey Part Number: 1276-1891-1-ND
C25 C29 = Cap: CAP CER 0.22UF 10V X5R 0603; Manufacturer Part-Number: GRM188R61A224KA01D; Manufacturer: Murata Electronics North America; ComponentLink1URL: http://search.murata.co.jp/Ceramy/image/img/A01X/G101/ENG/GRM188R61A224KA01-01.pdf; ComponentLink1Description: Datasheet; Digikey Part Number: 490-1537-1-ND
C26 C30 = Cap: CAP CER 10PF 50V C0G/NP0 0603; Manufacturer Part-Number: GRM1885C1H100JA01D; Manufacturer: Murata Electronics North America; ComponentLink1URL: http://search.murata.co.jp/Ceramy/image/img/A01X/G101/ENG/GRM1885C1H100JA01-01.pdf; ComponentLink1Description: Datasheet; Digikey Part Number: 490-1403-1-ND
C27 = Cap: CAP CER 10000PF 10V U2J 0603; Manufacturer Part-Number: GRM1857U1A103JA44D; Manufacturer: Murata Electronics North America; ComponentLink1URL: http://search.murata.co.jp/Ceramy/image/img/A01X/G101/ENG/GRM1857U1A103JA44-01.pdf; ComponentLink1Description: Datasheet; Digikey Part Number: 490-8269-1-ND
C31 = Cap: CAP CER 2PF 50V C0G/NP0 0603; Manufacturer Part-Number: CL10C020BB8NNNC; Manufacturer: Samsung Electro-Mechanics; ComponentLink1URL: http://www.samsungsem.com/kr/support/product-search/mlcc/__icsFiles/afieldfile/2016/08/18/S_CL10C020BB8NNNC.pdf; ComponentLink1Description: Datasheet; Digikey Part Number: 1276-1815-2-ND
C32 = Cap: CAP CER 1PF 50V C0G/NP0 0603; Manufacturer Part-Number: GRM1885C1H1R0WA01D; Manufacturer: Murata Electronics North America; ComponentLink1URL: http://search.murata.co.jp/Ceramy/image/img/A01X/G101/ENG/GRM1885C1H1R0WA01-01.pdf; ComponentLink1Description: Datasheet; Digikey Part Number: 490-16342-1-ND
J24 = U.FL-R-SMT-(10): CONN UMC RCPT STR 50 OHM SMD; Manufacturer Part-Number: 0734120110; Manufacturer: Molex, LLC; ComponentLink1URL: http://www.molex.com/pdm_docs/ps/PS-73598-021-001.pdf; ComponentLink1Description: Datasheet; Digikey Part Number: WM5587CT-ND
J25 J26 = Socket: Manufacturer Part-Number: 68000-200HLF; Manufacturer: Amphenol FCI; Description: BERGSTRIP .100" DR STRAIGHT; ComponentLink1URL: http://cdn.amphenol-icc.com/media/wysiwyg/files/drawing/68000.pdf; ComponentLink1Description: Datasheet; Digikey Part Number: 609-5099-1-ND
L2 = Ferrite_Bead: FERRITE BEAD 1 KOHM 0603 1LN; Manufacturer Part-Number: 74279266; Manufacturer: Wurth Electronics Inc.; ComponentLink1URL: http://katalog.we-online.de/pbs/datasheet/74279266.pdf; ComponentLink1Description: Datasheet; Digikey Part Number: 732-4484-1-ND
L3 = Inductor: FIXED IND 1.8NH 250MA 400 MOHM; Manufacturer Part-Number: LQP18MN1N8C02D; Manufacturer: Murata Electronics North America; ComponentLink1URL: http://search.murata.co.jp/Ceramy/image/img/P02/JELF243C-0009.pdf; ComponentLink1Description: Datasheet; Digikey Part Number: 490-11750-1-ND
L4 = Inductor: FIXED IND 3NH 670MA 170 MOHM SMD; Manufacturer Part-Number: LQW18AN3N0C80D; Manufacturer: Murata Electronics North America; ComponentLink1URL: http://search.murata.co.jp/Ceramy/image/img/P02/JELF243A-0102.pdf; ComponentLink1Description: Datasheet; Digikey Part Number: 490-11771-1-ND
P2 = Header 2: Header, 2-Pin; Manufacturer Part-Number: SPC02SYAN; Manufacturer: Sullins Connector Solutions; Description: CONN JUMPER SHORTING GOLD FLASH; ComponentLink1URL: http://www.sullinscorp.com/catalogs/282_PAGE124-125_.100_JUMPER.pdf; ComponentLink1Description: Datasheet; Digikey Part Number: S9001-ND
R10 = Res1: RES SMD 1 OHM 1% 1/10W 0603; Manufacturer Part-Number: RC0603FR-071RL; Manufacturer: Yageo; ComponentLink1URL: http://www.yageo.com/documents/recent/PYu-RC_Group_51_RoHS_L_8.pdf; ComponentLink1Description: Datasheet; Digikey Part Number: 311-1.00HRCT-ND
R12 = Res1: RES SMD 0 OHM JUMPER 1/10W 0603; Manufacturer Part-Number: RC0603JR-070RL; Manufacturer: Yageo; ComponentLink1URL: http://www.yageo.com/documents/recent/PYu-RC_Group_51_RoHS_L_8.pdf; ComponentLink1Description: Datasheet; Digikey Part Number: 311-0.0GRCT-ND
U6 = MCU: RF System on a Chip - SoC Blue Premium 19dBm 2.4G 512kB 64kB(RAM); Manufacturer Part-Number: EFR32BG13P732F512GM48-C; Manufacturer: Silicon Labs; ComponentLink1URL: http://www.mouser.com/ds/2/368/efr32bg13-datasheet-1114948.pdf; ComponentLink1Description: Datasheet; Mouser Part Number: 634-EFR32BG13P732-C
Y1 = X1: Manufacturer Part-Number: CT1612DB38400C0FLHA1; Manufacturer: AVX Corp/Kyocera Corp; Description: CRYSTAL 38.4000MHZ 7PF SMD; ComponentLink1URL: https://media.digikey.com/pdf/Data%20Sheets/AVX%20PDFs/CT1612DB38400C0FLHA1_Spec~.pdf; ComponentLink1Description: Datasheet; Digikey Part Number: 1253-1777-1-ND
Y2 = X2: CRYSTAL 32.7680KHZ 12.5PF SMD; Manufacturer Part-Number: 9HT10-32.768KDZF-T; Manufacturer: TXC CORPORATION; ComponentLink1URL: http://www.txccorp.com/download/products/quartz_crystals/2015TXC_9HT10_31.pdf; ComponentLink1Description: Datasheet; Digikey Part Number: 887-1504-1-ND

## Nets that join several sheets
GND: Inductive (22 pins), BatteryCharger (13 pins), MCU (8 pins), MCU_PART2 (22 pins)
VCC: MCU (U7.5), MCU_PART2 (18 pins)
VIN: Inductive (7 pins), BatteryCharger (Cin1.1 U2.1)
Vout: BatteryCharger (C35.1 J6.1 U1.2 U1.3), MCU_PART2 (J25.1 P2.1)